# EasyEDA schematic USBtoMIDI.json
TITLE: USBtoMIDI; REV: 1.0; Date: 2022-04-28; Sheet: 1/1; Drawn By: OctSL; Company: Your Company
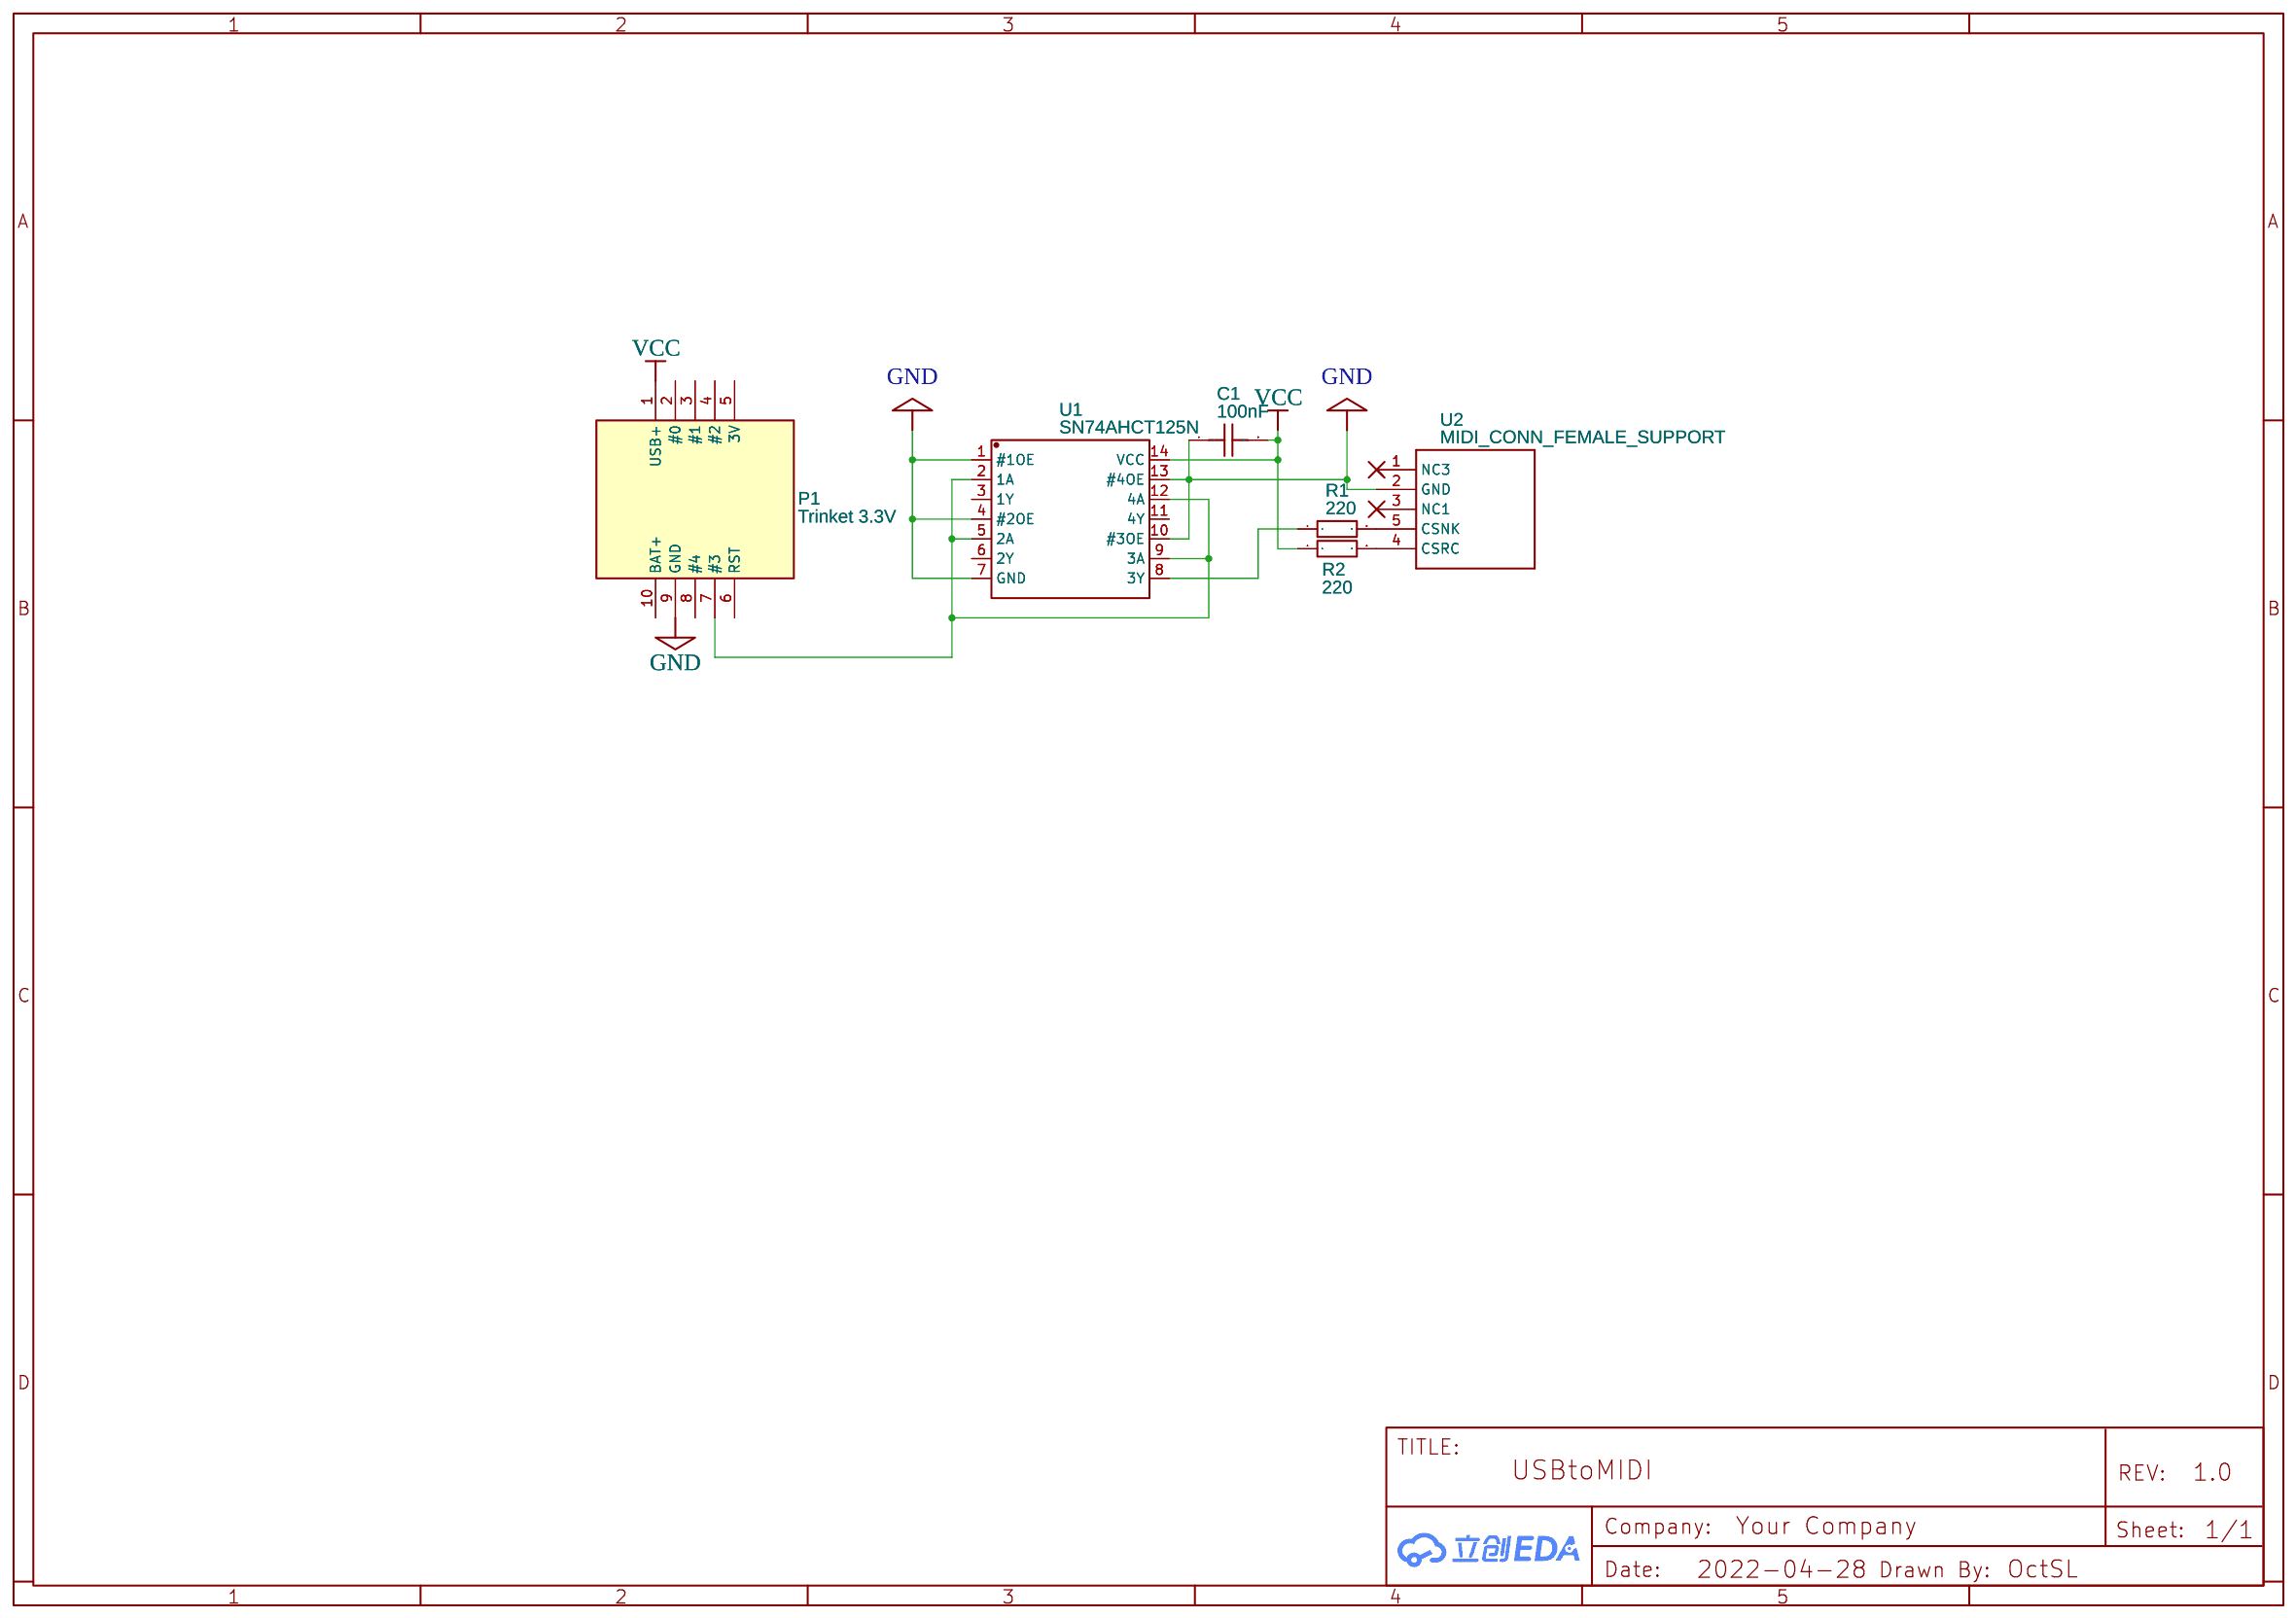
[diagram p0: schematic sheet]

## Parts
C1  100nF  [CAP-TH_BD2.2-L3.2-P5.08-D0.6]
P1  Trinket 3.3V  [TRINKET 3.3V]
R1  220  [RES-TH_BD2.3-L6.5-P10.50-D0.5]
R2  220  [RES-TH_BD2.3-L6.5-P10.50-D0.5]
U1  SN74AHCT125N  [PDIP-14_L19.3-W6.4-P2.54-LS7.6-BL]
U2  MIDI_CONN_FEMALE_SUPPORT  [DIN_5_FEMALE_SUPPORT]

## Library data of the parts
C1 = ACC-B104K500P: Supplier: LCSC; Manufacturer: FH; Contributor: LCSC; Supplier Part: C94703; JLCPCB Part Class: Extended Part
P1 = Trinket 3.3V: sourceId: 1T5FDZYC8
R1 R2 = RI40-1/4W-1MΩ±5% T: Supplier: LCSC; Supplier Part: C122180; Manufacturer: Chian Chia Elec; Contributor: LCSC; JLCPCB Part Class: Extended Part
U1 = SN74AHCT125N: Supplier: LCSC; Supplier Part: C354152; Manufacturer: Texas Instruments; Contributor: LCSC; JLCPCB Part Class: Extended Part
U2 = MIDI_CONN_FEMALE_SUPPORT: MIDI connector with strain relief (DIN-5 female); Contributor: SparkFun

## Nets
GND: C1.1 P1.9(GND) U1.1(#1OE) U1.4(#2OE) U1.7(GND) U1.10(#3OE) U1.13(#4OE) U2.2(GND)
VCC: C1.2 P1.1(USB+) R2.1 U1.14(VCC)
Net-(P1-7): P1.7(#3) U1.2(1A) U1.5(2A) U1.9(3A) U1.12(4A)
Net-(R1-1): R1.1 U1.8(3Y)
Net-(R1-2): R1.2 U2.5(CSNK)
Net-(R2-2): R2.2 U2.4(CSRC)

Not connected (* = marked no-connect by the designer): P1 2(#0) 3(#1) 4(#2) 5(3V) 6(RST) 8(#4) 10(BAT+); U1 3(1Y) 6(2Y) 11(4Y); U2 1(NC3) 3(NC1)
